# EAGLE design main-comp (EAGLE 6.4)
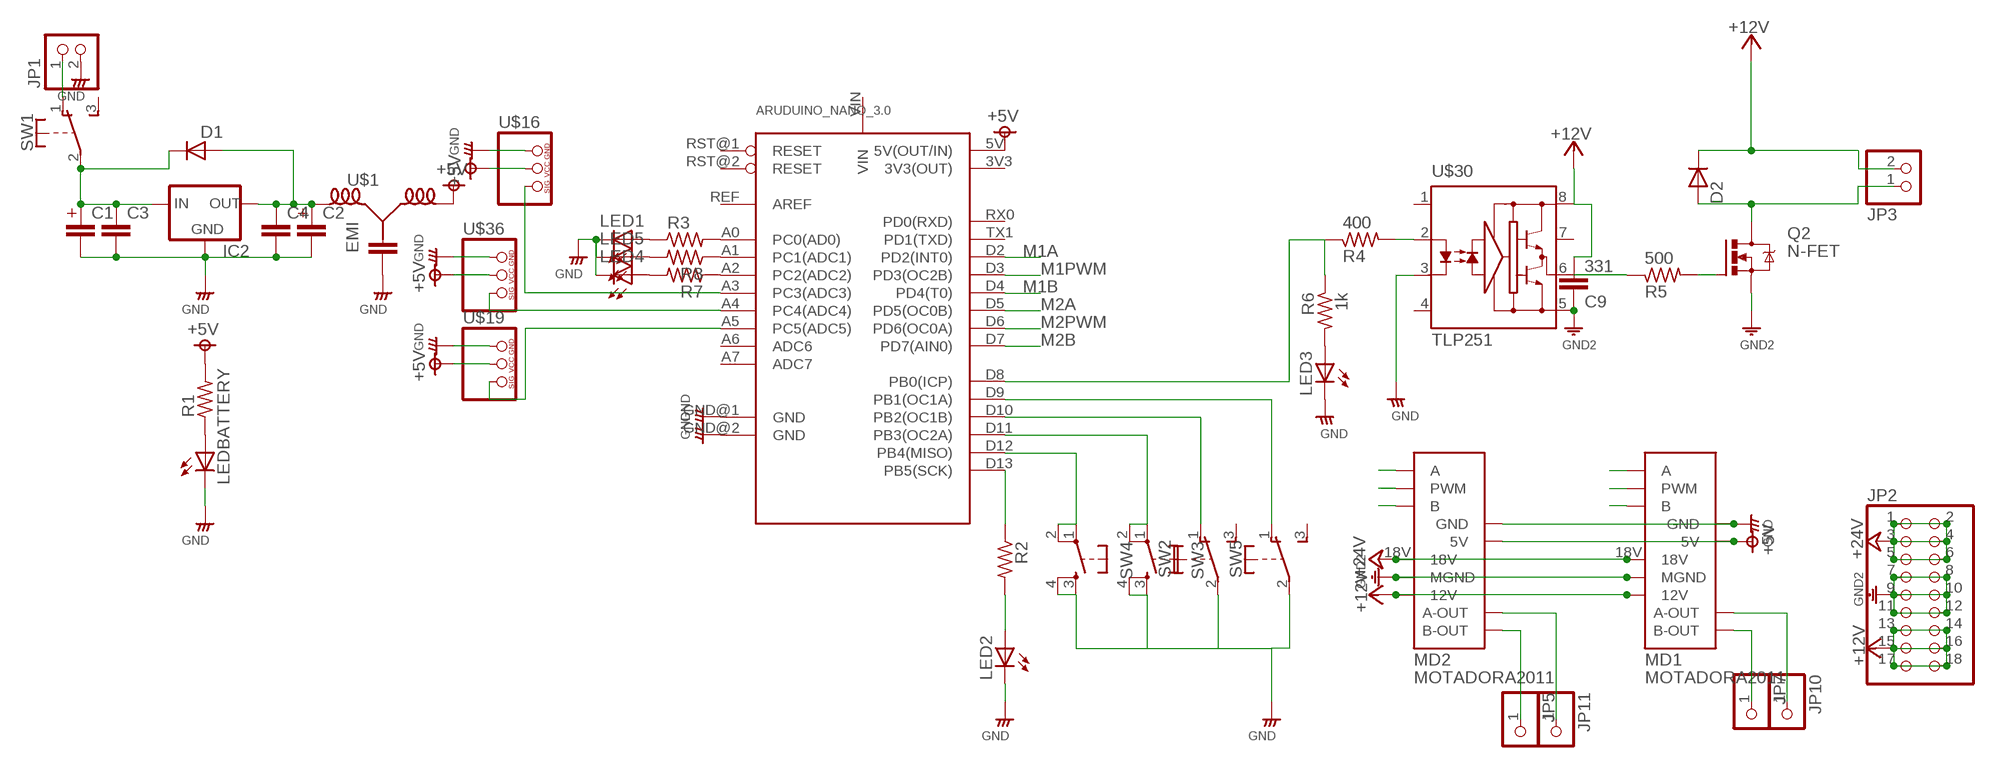
[diagram p0: schematic, sheet 1]

## Parts
C1  CAPACITOR-330U  [C_330U]
C2  CAPACITOR-330U  [C_330U]
C3  MLCC-3  [MLCC_50]
C4  MLCC-3  [MLCC_50]
C9  331  MLCC-3  [MLCC_50]
D1  DIODE_3  [DIODE_3]
D2  DIODE_4  [DIODE_4]
IC2  78  [78XX]
JP1  PINHD-1X2"  [1*02]
JP2  PINHD-2X9  [2X09]
JP3  PINHD-1X2  [1X02]
JP5  PINHD-1X1  [1X01]
JP7  PINHD-1X1  [1X01]
JP10  PINHD-1X1  [1X01]
JP11  PINHD-1X1  [1X01]
LED1  LED3MM  [LED3MM]
LED2  LED3MM  [LED3MM]
LED3  LED3MM  [LED3MM]
LED4  LED3MM  [LED3MM]
LED5  LED3MM  [LED3MM]
LEDBATTERY  LED5MM  [LED5MM]
MD1  MOTADORA2011  [MOTADORA2010]
MD2  MOTADORA2011  [MOTADORA2010]
Q2  N-FET  [TO-220V]
R1  RESISTORS-2  [R_0.2]
R2  RESISTORS3216  [3216]
R3  RESISTORS3216  [3216]
R4  400  RESISTORS-2  [R_0.2]
R5  500  RESISTORS3216  [3216]
R6  1k  RESISTORS3216  [3216]
R7  RESISTORS3216  [3216]
R8  RESISTORS3216  [3216]
SW1  TOGGLE  [9450-2]
SW2  TOGGLE  [9450-2]
SW3  TACTB3F  [B3F-10XX]
SW4  TACTB3F  [B3F-10XX]
SW5  TOGGLE  [9450-2]
U$1  EMI  [EMI_3]
U$14  ARUDUINO_NANO_3.0  [ARYDUINO_NANO_3.0]
U$16  PINHD-SENSOR  [1*03(KIKAKU)]
U$19  PINHD-SENSOR  [1*03(KIKAKU)]
U$30  TLP251  [DIP8]
U$36  PINHD-SENSOR  [1*03(KIKAKU)]

## Nets
+5V: MD1.5V MD2.5V R1.2 U$1.3 U$14.5V(5V(OUT/IN)) U$16.VCC U$19.VCC U$36.VCC
+12V: C9.2 D2.C JP2.13 JP2.14 JP2.15 JP2.16 JP2.17 JP2.18 JP3.2 MD1.12V MD2.12V U$30.8
+24V: JP2.1 JP2.2 JP2.3 JP2.4 JP2.5 JP2.6 MD1.18V MD2.18V
GND: C1.P$2 C2.P$2 C3.2 C4.2 IC2.P$2(GND) JP1.2 LED1.K(C) LED2.K(C) LED3.K(C) LED4.K(C) LED5.K(C) LEDBATTERY.K(C) MD1.GND MD2.GND SW2.2(P) SW3.3(S) SW3.4(S1) SW4.3(S) SW4.4(S1) SW5.2(P) U$1.2 U$14.GND@1(GND) U$14.GND@2(GND) U$16.GND U$19.GND U$30.3 U$36.GND
GND12: C9.1 JP2.7 JP2.8 JP2.9 JP2.10 JP2.11 JP2.12 MD1.MGND MD2.MGND Q2.3(S) U$30.5 ; supply symbol labelled GND2
M1A: MD1.A U$14.D2(PD2(INT0))
M1B: MD1.B U$14.D4(PD4(T0))
M1PWM: MD1.PWM U$14.D3(PD3(OC2B))
M2A: MD2.A U$14.D5(PD5(OC0B))
M2B: MD2.B U$14.D7(PD7(AIN0))
M2PWM: MD2.PWM U$14.D6(PD6(OC0A))
N$1: U$14.A3(PC3(ADC3)) U$16.SIG
N$2: R3.2 U$14.A0(PC0(AD0))
N$3: JP1.1 SW1.1(O)
N$4: U$14.A4(PC4(ADC4)) U$36.SIG
N$5: C1.P$1 C3.1 D1.C IC2.P$1(IN) SW1.2(P)
N$6: U$14.A5(PC5(ADC5)) U$19.SIG
N$7: LED4.A R7.2
N$8: R4.1 R6.1 U$14.D8(PB0(ICP))
N$11: C2.P$1 C4.1 D1.A IC2.P$3(OUT) U$1.1
N$12: R8.1 U$14.A1(PC1(ADC1))
N$13: LED1.A R3.1
N$14: SW2.1(O) U$14.D10(PB2(OC1B))
N$15: SW5.1(O) U$14.D9(PB1(OC1A))
N$18: R2.1 U$14.D13(PB5(SCK))
N$19: R7.1 U$14.A2(PC2(ADC2))
N$20: SW4.1(P) SW4.2(P1) U$14.D12(PB4(MISO))
N$21: LEDBATTERY.A R1.1
N$22: SW3.1(P) SW3.2(P1) U$14.D11(PB3(OC2A))
N$23: LED2.A R2.2
N$26: LED5.A R8.2
N$28: JP11.1 MD2.A-OUT
N$29: JP7.1 MD1.B-OUT
N$30: JP10.1 MD1.A-OUT
N$32: Q2.1(G) R5.2
N$33: JP5.1 MD2.B-OUT
N$36: D2.A JP3.1 Q2.2(D)
N$37: R4.2 U$30.2
N$38: R5.1 U$30.6
N$39: LED3.A R6.2
Unconnected: SW1.3(S) SW2.3(S) SW5.3(S) U$14.3V3(3V3(OUT)) U$14.A6(ADC6) U$14.A7(ADC7) U$14.REF(AREF) U$14.RST@1(RESET) U$14.RST@2(RESET) U$14.RX0(PD0(RXD)) U$14.TX1(PD1(TXD)) U$14.VIN U$30.1 U$30.4 U$30.7

## Library data of the parts
C1 C2 = rcl__s:CAPACITOR
C3 C4 C9 = rcl__s:MLCC: CAPACITOR, European symbol
D1 D2 = diode_s:DIODE
IC2 = regulator_s:78*: VOLTAGE REGULATOR
JP1 JP3 = pinhead_s:PINHD-1X2: PIN HEADER
JP2 = pinhead_s:PINHD-2X9: PIN HEADER
JP5 JP7 JP10 JP11 = pinhead_s:PINHD-1X1: PIN HEADER
LED1-LED5 LEDBATTERY = LED_s:LED: LED OSRAM: - CHIPLED LG R971, LG N971, LY N971, LG Q971, LY Q971, LO R971, LY R971 LH N974, LH R974 LS Q976, LO Q976, LY Q976 LO Q996 - Hyper CHIPLED LW Q18S LB Q993, LB Q99A, LB R99A - SideLED LS A670, LO A670, LY A670, LG A670, LP A670 LB A673, LV A673, LT A673, LW A673 LH A674 LY A675 LS A676, LA A676, LO A676, LY A676, LW A676 LS A679, LY A679, LG A679 - Hyper Micro SIDELED® LS Y876, LA Y876, LO Y876, LY Y876 LT Y87S - SmartLED LW L88C, LW L88S LB L89C, LB L89S, LG L890 LS L89K, LO L89K, LY L89K LS L896, LA L896, LO L896, LY L896 - TOPLED LS T670, LO T670, LY T670, LG T670, LP T670 LSG T670, LSP T670, LSY T670, LOP T670, LYG T670 LG T671, LOG T671, LSG T671 LB T673, LV T673, LT T673, LW T673 LH T674 LS T676, LA T676, LO T676, LY T676, LB T676, LH T676, LSB T676, LW T676 LB T67C, LV T67C, LT T67C, LS T67K, LO T67K, LY T67K, LW E67C LS E67B, LA E67B, LO E67B, LY E67B, LB E67C, LV E67C, LT E67C LW T67C LS T679, LY T679, LG T679 LS T770, LO T770, LY T770, LG T770, LP T770 LB T773, LV T773, LT T773, LW T773 LH T774 LS E675, LA E675, LY E675, LS T675 LS T776, LA T776, LO T776, LY T776, LB T776 LHGB T686 LT T68C, LB T68C - Hyper Mini TOPLED® LB M676 - Mini TOPLED Santana® LG M470 LS M47K, LO M47K, LY M47K Source: http://www.osram.convergy.de - LUMILED® LXK2-PW12-R00, LXK2-PW12-S00, LXK2-PW14-U00, LXK2-PW14-V00 LXK2-PM12-R00, LXK2-PM12-S00, LXK2-PM14-U00 LXK2-PE12-Q00, LXK2-PE12-R00, LXK2-PE12-S00, LXK2-PE14-T00, LXK2-PE14-U00 LXK2-PB12-K00, LXK2-PB12-L00, LXK2-PB12-M00, LXK2-PB14-N00, LXK2-PB14-P00, LXK2-PB14-Q00 LXK2-PR12-L00, LXK2-PR12-M00, LXK2-PR14-Q00, LXK2-PR14-R00 LXK2-PD12-Q00, LXK2-PD12-R00, LXK2-PD12-S00 LXK2-PH12-R00, LXK2-PH12-S00 LXK2-PL12-P00, LXK2-PL12-Q00, LXK2-PL12-R00 Source: www.luxeon.com
MD1 MD2 = motadora2011:MOTADORA2011
Q2 = FET_s:N-FET
R1-R8 = rcl__s:RESISTORS
SW1 SW2 SW5 = switch_s:TOGGLE
SW3 SW4 = switch_s:TACT: OMRON SWITCH
U$1 = rcl__s:EMI
U$14 = aruduino:ARUDUINO_NANO_3.0
U$16 U$19 U$36 = pinhead_s:PINHD-SENSOR
U$30 = photocoupler_s:TLP251

## Board
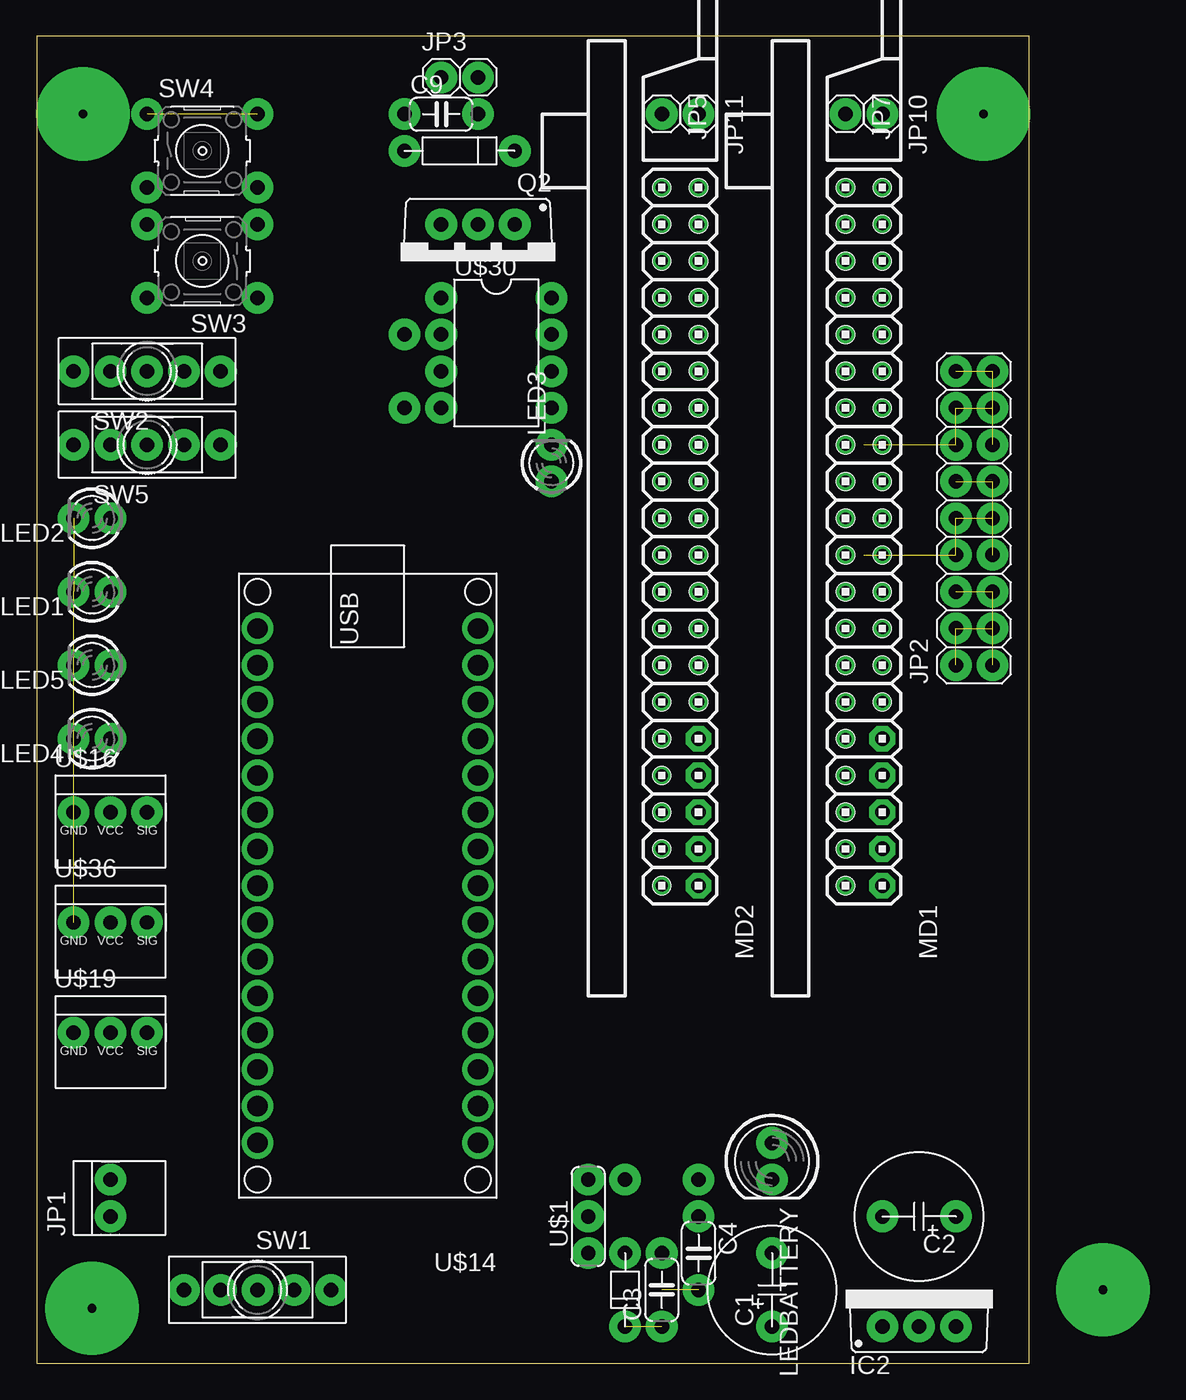
[diagram p1: board, top side]
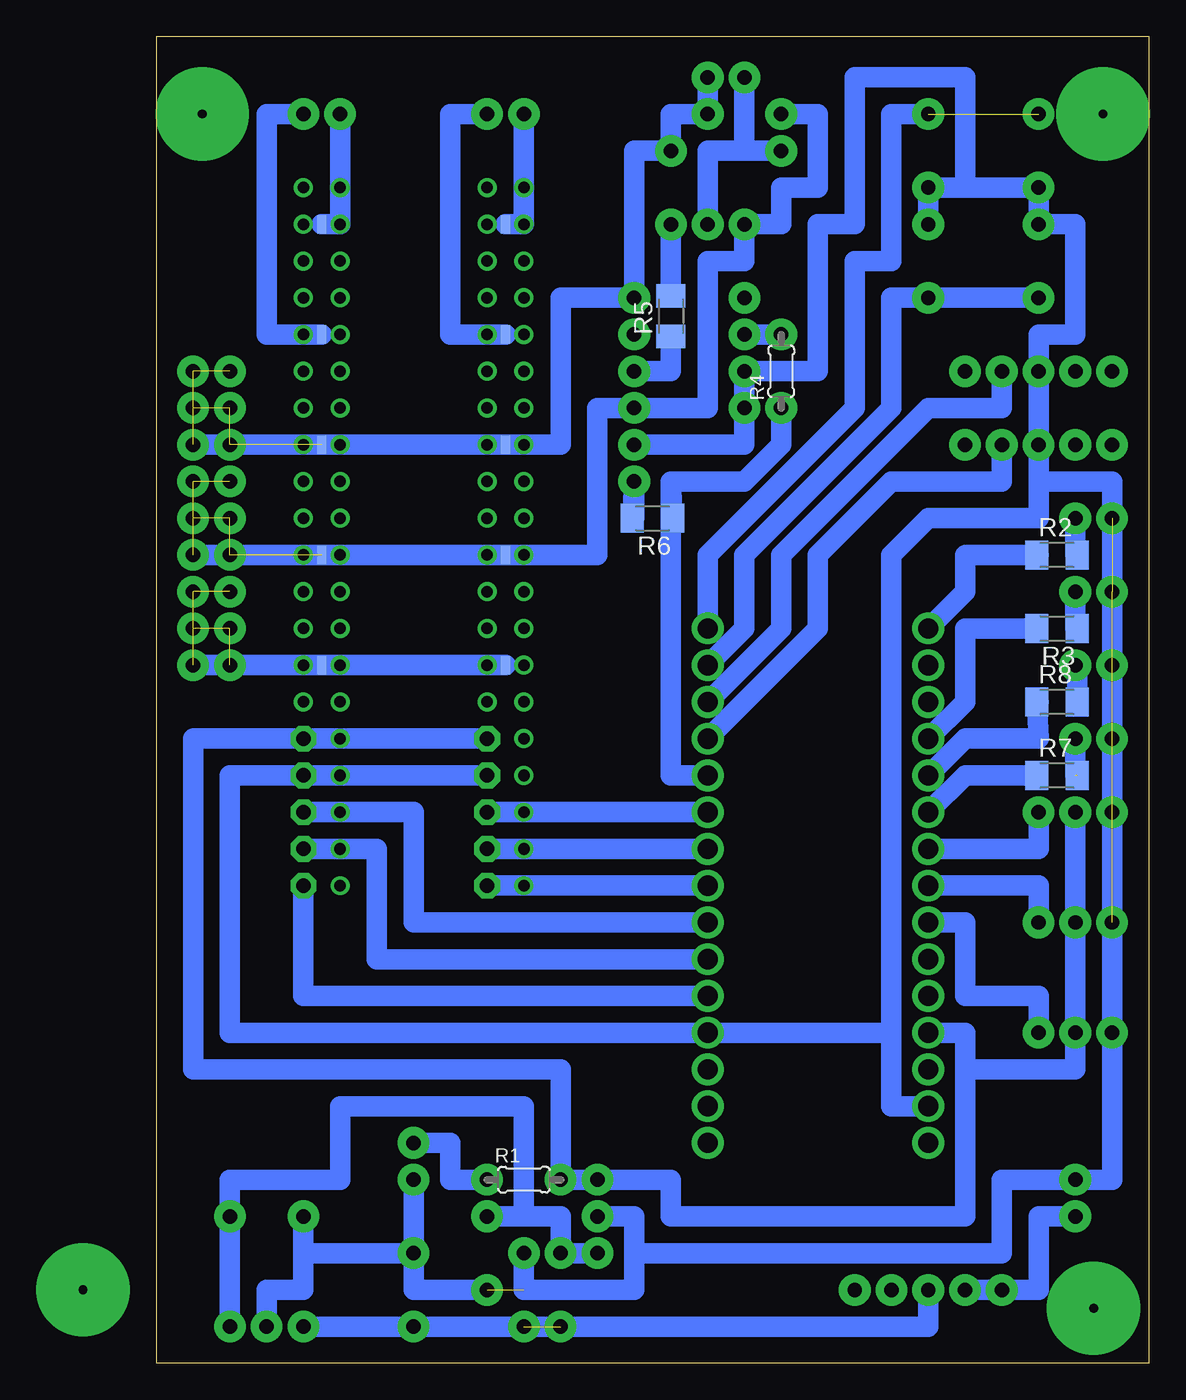
[diagram p2: board, bottom side, seen from below]

Size 68.56 x 91.75 mm. Coordinates in mm from the lower left corner, seen from the top.
Outline: 0,0 68.56,0 68.56,91.75 0,91.75 0,0
Copper layers (1*16): Top 0.035mm / dielectric 1.5mm / Bottom 0.035mm
Design rules "default": minimum track width 10mil, minimum drill 24mil, track to track 8mil, track to pad 8mil, pad to pad 8mil, via to via 8mil, smd to smd 8mil, copper to edge 40mil, drill to drill 8mil, minimum pad ring 10mil, minimum via ring 8mil, stop-mask expansion 4mil, vias tented up to drill 0mil, thermal gap 10mil

### Footprints (pad centres in the part's own frame; a part is rotated, then mirrored left to right if it is on the bottom)
C_330U = drill 1 pad 2.184: P$1 -2.54,0; P$2 2.54,0
MLCC_50 = drill 1 pad 2.184: 1 -2.54,0; 2 2.54,0
DIODE_3 = drill 1 pad 2.184: A -2.54,0; C 2.54,0
DIODE_4 = drill 1 pad 2.184: A -5.08,0; C 2.54,0
78XX = drill 1 pad 2.184: P$1 -2.54,0; P$2 0,0; P$3 2.54,0
1*02 = drill 1 pad 2.184: 1 -1.27,0; 2 1.27,0
2X09 = drill 1 pad 2.184: 1 -10.16,-1.27; 2 -10.16,1.27; 3 -7.62,-1.27; 4 -7.62,1.27; 5 -5.08,-1.27; 6 -5.08,1.27; 7 -2.54,-1.27; 8 -2.54,1.27; 9 0,-1.27; 10 0,1.27; 11 2.54,-1.27; 12 2.54,1.27; 13 5.08,-1.27; 14 5.08,1.27; 15 7.62,-1.27; 16 7.62,1.27; 17 10.16,-1.27; 18 10.16,1.27
1X02 = drill 1 pad 2.184: 1 -1.27,0; 2 1.27,0
1X01 = drill 1 pad 2.184: 1 0,0
LED3MM = drill 1 pad 2.184: A -1.27,0; K 1.27,0
LED5MM = drill 1 pad 2.184: A -1.27,0; K 1.27,0
MOTADORA2010 = drill 1.001 pad 1.778 octagon: 5V -15.24,-1.27; A -25.4,-1.27; B -20.32,-1.27; GND -17.78,-1.27; PWM -22.86,-1.27 | smd 1.27 x 0.635 bottom: 12V 5.08,0; 18V -10.16,0; A-OUT 12.7,0; B-OUT 20.32,0; MGND -2.54,0 | drill 0.8: P$1 -25.4,1.27; P$2 -22.86,1.27; P$3 -20.32,1.27; P$4 -17.78,1.27; P$5 -15.24,1.27; P$6 -12.7,1.27; P$7 -12.7,-1.27; P$8 -10.16,-1.27; P$9 -10.16,1.27; P$10 -7.62,1.27; P$11 -7.62,-1.27; P$12 -5.08,-1.27; P$13 -5.08,1.27; P$14 -2.54,1.27; P$15 -2.54,-1.27; P$16 0,-1.27; P$17 0,1.27; P$18 2.54,1.27; P$19 5.08,1.27; P$20 5.08,-1.27; P$21 2.54,-1.27; P$22 7.62,-1.27; P$23 7.62,1.27; P$24 10.16,1.27; P$25 10.16,-1.27; P$26 12.7,1.27; P$27 12.7,-1.27; P$28 15.24,-1.27; P$29 15.24,1.27; P$30 17.78,1.27; P$31 17.78,-1.27; P$32 20.32,-1.27; P$33 20.32,1.27; P$34 22.86,1.27; P$35 22.86,-1.27
TO-220V = drill 1 pad 2.184: 1 -2.54,0; 2 0,0; 3 2.54,0
R_0.2 = drill 1 pad 2.184: 1 -2.54,0; 2 2.54,0
3216 = smd 1.6 x 2: 1 -1.4,0; 2 1.4,0
9450-2 = drill 1 pad 2.184: 1 -2.54,0; 2 0,0; 3 2.54,0; F1 -5.08,0; F2 5.08,0
B3F-10XX = drill 1 pad 2.184: 1 -3.81,2.54; 2 3.81,2.54; 3 -3.81,-2.54; 4 3.81,-2.54
EMI_3 = drill 1 pad 2.184: 1 -2.54,0; 2 0,0; 3 2.54,0
ARYDUINO_NANO_3.0 = drill 1.4 pad 2.184: 3V3 7.62,-15.24; 5V 7.62,10.16; A0 7.62,-10.16; A1 7.62,-7.62; A2 7.62,-5.08; A3 7.62,-2.54; A4 7.62,0; A5 7.62,2.54; A6 7.62,5.08; A7 7.62,7.62; D2 -7.62,7.62; D3 -7.62,5.08; D4 -7.62,2.54; D5 -7.62,0; D6 -7.62,-2.54; D7 -7.62,-5.08; D8 -7.62,-7.62; D9 -7.62,-10.16; D10 -7.62,-12.7; D11 -7.62,-15.24; D12 -7.62,-17.78; D13 7.62,-17.78; GND@1 -7.62,10.16; GND@2 7.62,15.24; REF 7.62,-12.7; RST@1 -7.62,12.7; RST@2 7.62,12.7; RX0 -7.62,15.24; TX1 -7.62,17.78; VIN 7.62,17.78
1*03(KIKAKU) = drill 1 pad 2.184: GND -2.54,1.27; SIG 2.54,1.27; VCC 0,1.27
DIP8 = drill 1 pad 2.184: 1 -3.81,-3.81; 2 -1.27,-3.81; 3 1.27,-3.81; 4 3.81,-3.81; 5 3.81,3.81; 6 1.27,3.81; 7 -1.27,3.81; 8 -3.81,3.81

### Placement (x,y rotation side)
C1  50.8,5.08 90 top
C2  60.96,10.16 180 top
C3  43.18,5.08 90 top
C4  45.72,7.62 270 top
C9  27.94,86.36 0 top
D1  40.64,5.08 270 top
D2  30.48,83.82 0 top
IC2  60.96,2.54 0 top
JP1  5.08,11.43 90 top
JP2  64.77,58.42 90 top
JP3  29.21,88.9 0 top
JP5  43.18,86.36 270 top
JP7  55.88,86.36 270 top
JP10  58.42,86.36 270 top
JP11  45.72,86.36 270 top
LED1  3.81,53.34 180 top
LED2  3.81,58.42 180 top
LED3  35.56,62.23 90 top
LED4  3.81,43.18 180 top
LED5  3.81,48.26 180 top
LEDBATTERY  50.8,13.97 270 top
MD1  57.15,58.42 90 top
MD2  44.45,58.42 90 top
Q2  30.48,78.74 180 top
R1  43.18,12.7 0 bottom
R2  6.35,55.88 0 bottom
R3  6.35,50.8 180 bottom
R4  25.4,68.58 90 bottom
R5  33.02,72.39 90 bottom
R6  34.29,58.42 180 bottom
R7  6.35,40.64 0 bottom
R8  6.35,45.72 0 bottom
SW1  15.24,5.08 0 top
SW2  7.62,68.58 180 top
SW3  11.43,76.2 180 top
SW4  11.43,83.82 0 top
SW5  7.62,63.5 180 top
U$1  38.1,10.16 90 top
U$14  22.86,33.02 180 top
U$16  5.08,36.83 0 top
U$19  5.08,21.59 0 top
U$30  31.75,69.85 270 top
U$36  5.08,29.21 0 top

### Tracks (layer width: path | path; a pad name or v marks a point on that pad's centre or on a via)
+5V
  Bottom 1.422: U$16.VCC U$36.VCC U$19.VCC 5.08,20.32 12.7,20.32 | 12.7,20.32 12.7,22.86 U$14.5V | 12.7,20.32 12.7,10.16 33.02,10.16 33.02,12.7 U$1.3 R1.2 40.64,20.32 66.04,20.32 66.04,43.18 MD1.5V MD2.5V
+12V  (6 unrouted)
  Bottom 1.422: JP2.13 MD2.12V 40.64,63.5 40.64,73.66 U$30.8 35.56,83.82 D2.C 33.02,86.36 C9.2 JP3.2
+24V  (5 unrouted)
  Bottom 1.422: MD2.18V MD1.18V | MD1.18V 58.42,48.26 | MD1.18V JP2.1
GND  (6 unrouted)
  Bottom 1.422: U$19.GND LED2.K 2.54,60.96 7.62,60.96 | U$19.GND 2.54,21.59 | U$19.GND 2.54,12.7 JP1.2 10.16,12.7 10.16,7.62 35.56,7.62 | C4.2 50.8,5.08 C1.P$2 | 58.42,7.62 58.42,5.08 60.96,5.08 IC2.P$2 | 58.42,7.62 C2.P$2 | C1.P$2 58.42,7.62 | 35.56,7.62 35.56,10.16 U$1.2 | 35.56,7.62 35.56,5.08 43.18,5.08 C3.2 | U$14.GND@2 17.78,17.78 17.78,22.86 | 17.78,22.86 U$14.GND@1 63.5,22.86 63.5,40.64 MD1.GND MD2.GND | C1.P$2 LEDBATTERY.K | LED3.K 27.94,63.5 U$30.3 22.86,68.58 22.86,78.74 20.32,78.74 20.32,88.9 12.7,88.9 12.7,81.28 SW4.4 | SW3.3 SW4.4 | SW4.4 SW4.3 SW3.4 5.08,78.74 5.08,71.12 7.62,71.12 SW2.2 SW5.2 7.62,60.96 | 17.78,22.86 17.78,55.88 15.24,58.42 7.62,58.42 7.62,60.96
GND12  (6 unrouted)
  Bottom 1.422: JP2.7 MD2.MGND 38.1,55.88 38.1,66.04 U$30.5 30.48,66.04 30.48,76.2 27.94,76.2 Q2.3 25.4,78.74 25.4,81.28 22.86,81.28 22.86,86.36 C9.1
M1A
  Bottom 1.422: U$14.D2 58.42,25.4 MD1.A
M1B
  Bottom 1.422: U$14.D4 50.8,30.48 50.8,38.1 MD1.B
M1PWM
  Bottom 1.422: U$14.D3 53.34,27.94 53.34,35.56 MD1.PWM
M2A
  Bottom 1.422: MD2.A U$14.D5
M2B
  Bottom 1.422: MD2.B U$14.D7
M2PWM
  Bottom 1.422: MD2.PWM U$14.D6
N$1
  Bottom 1.422: U$14.A3 7.62,35.56 U$16.SIG
N$2
  Bottom 1.422: R3.2 12.7,50.8 12.7,45.72 U$14.A0
N$3
  Bottom 1.422: JP1.1 7.62,10.16 7.62,5.08 SW1.1
N$4
  Bottom 1.422: U$14.A4 7.62,33.02 U$36.SIG
N$5  (1 unrouted)
  Bottom 1.422: SW1.2 15.24,2.54 C3.1 C1.P$1 IC2.P$1
N$6
  Bottom 1.422: U$14.A5 12.7,30.48 12.7,25.4 7.62,25.4 U$19.SIG
N$7  (1 unrouted)
  Bottom 1.422: 5.08,40.64 LED4.A
N$8
  Bottom 1.422: U$14.D8 33.02,40.64 33.02,60.96 | R6.1 33.02,60.96 | 33.02,60.96 27.94,60.96 25.4,63.5 R4.1
N$9  (via drill 0.6 pad 6.45)
  other vias: 65.4,86.36
N$10  (via drill 0.6 pad 6.45)
  other vias: 3.81,3.81
N$11
  Bottom 1.422: IC2.P$3 C2.P$1 63.5,12.7 55.88,12.7 55.88,17.78 43.18,17.78 43.18,10.16 | U$1.1 D1.A 40.64,10.16 43.18,10.16 | 43.18,10.16 C4.1
N$12
  Bottom 1.422: 7.62,45.72 R8.1 7.62,43.18 12.7,43.18 U$14.A1
N$13
  Bottom 1.422: R3.1 5.08,50.8 LED1.A
N$14
  Bottom 1.422: U$14.D10 25.4,50.8 25.4,55.88 15.24,66.04 10.16,66.04 SW2.1
N$15
  Bottom 1.422: U$14.D9 22.86,50.8 22.86,55.88 17.78,60.96 10.16,60.96 SW5.1
N$16  (via drill 0.6 pad 6.45)
  other vias: 3.17,86.36
N$17  (via drill 0.6 pad 6.45)
  other vias: 73.66,5.08
N$18
  Bottom 1.422: U$14.D13 12.7,53.34 12.7,55.88 R2.1 7.62,55.88
N$19
  Bottom 1.422: U$14.A2 12.7,40.64 R7.1
N$20  (1 unrouted)
  Bottom 1.422: U$14.D12 30.48,55.88 20.32,66.04 20.32,76.2 17.78,76.2 17.78,86.36 SW4.2
N$21
  Bottom 1.422: R1.1 48.26,12.7 48.26,15.24 LEDBATTERY.A
N$22
  Bottom 1.422: U$14.D11 27.94,50.8 27.94,55.88 17.78,66.04 17.78,73.66 SW3.1 SW3.2
N$23
  Bottom 1.422: R2.2 5.08,55.88 LED2.A
N$26
  Bottom 1.422: R8.2 4.95,48.26 LED5.A
N$28
  Bottom 1.422: MD2.A-OUT 48.26,71.12 48.26,86.36 JP11.1
N$29
  Bottom 1.422: MD1.B-OUT 55.88,78.74 JP7.1
N$30
  Bottom 1.422: MD1.A-OUT 60.96,71.12 60.96,86.36 JP10.1
N$32
  Bottom 1.422: R5.2 Q2.1
N$33
  Bottom 1.422: MD2.B-OUT 43.18,78.74 JP5.1
N$36
  Bottom 1.422: Q2.2 30.48,83.82 27.94,83.82 | 27.94,83.82 D2.A | JP3.1 27.94,83.82
N$37
  Bottom 1.422: U$30.2 R4.2
N$38
  Bottom 1.422: R5.1 33.02,68.58 U$30.6
N$39
  Bottom 1.422: R6.2 35.69,58.29 LED3.A 35.56,58.42